# EAGLE design new main (EAGLE 6.5.0)
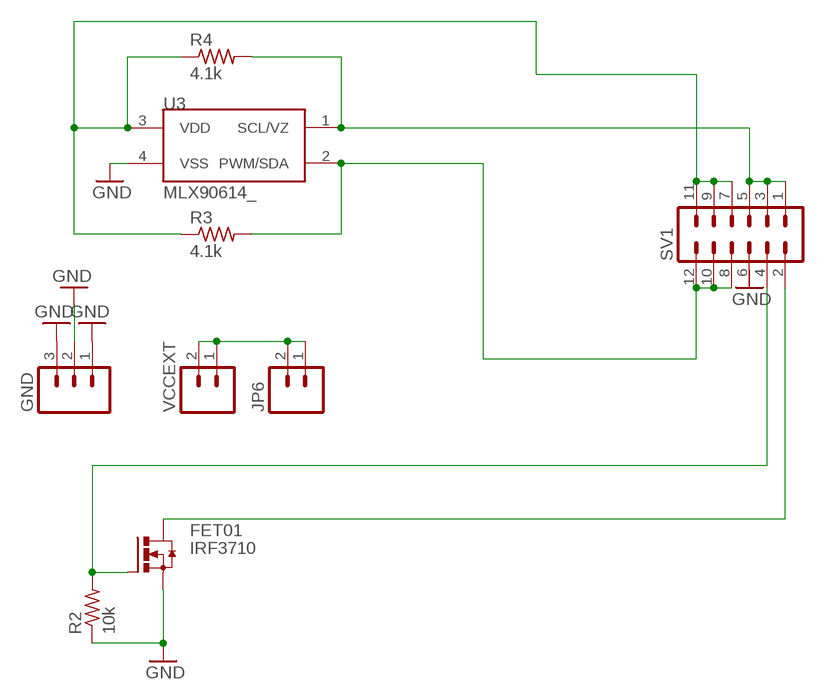
[diagram p0: schematic, sheet 1]

## Parts
FET01  IRF3710  IRF3704  [TO220AH]
GND  M03LONGPADS  [1X03_LONGPADS]
JP6  M02LOCK_LONGPADS  [1X02_LOCK_LONGPADS]
R2  10k  R-US_0207/7  [0207/7]
R3  4.1k  R-US_0204/5  [0204/5]
R4  4.1k  R-US_0204/5  [0204/5]
SV1  MA06-2  [MA06-2]
U3  MLX90614_  [TO-39]
VCCEXT  M02LOCK_LONGPADS  [1X02_LOCK_LONGPADS]

## Nets
GND: FET01.E(S) GND.1 GND.2 GND.3 R2.1 U3.4(VSS)
N$1: JP6.1 JP6.2 VCCEXT.1 VCCEXT.2
N$2: FET01.C(D) SV1.2
N$15: R4.2 SV1.1 SV1.3 SV1.5 U3.1(SCL/VZ)
N$16: R3.2 SV1.8 SV1.10 SV1.12 U3.2(PWM/SDA)
N$18: FET01.B(G) R2.2 SV1.4
VCC3: R3.1 R4.1 SV1.7 SV1.9 SV1.11 U3.3(VDD)
Unconnected: SV1.6

## Library data of the parts
FET01 = transistor-power:IRF3704: SMPS MOSFET HEXFET® Power MOSFET Source: http://www.irf.com/product-info/datasheets/data/irf3704.pdf
GND = SparkFun-Connectors:M03: Header 3 Standard 3-pin 0.1" header. Use with straight break away headers (SKU : PRT-00116), right angle break away headers (PRT-00553), swiss pins (PRT-00743), machine pins (PRT-00117), and female headers (PRT-00115). Molex polarized connector foot print use with SKU : PRT-08232 with associated crimp pins and housings.
JP6 VCCEXT = SparkFun-Connectors:M02: Header 2 Standard 2-pin 0.1" header. Use with straight break away headers (SKU : PRT-00116), right angle break away headers (PRT-00553), swiss pins (PRT-00743), machine pins (PRT-00117), and female headers (PRT-00115). Molex polarized connector foot print use with SKU : PRT-08233 with associated crimp pins and housings.
R2-R4 = rcl:R-US_: RESISTOR, American symbol
SV1 = con-lstb:MA06-2: PIN HEADER; OC_FARNELL: unknown; OC_NEWARK: unknown
U3 = SparkFun-Sensors:MLX90614: Non-contact PIR I2C interface temperature sensor

## Board
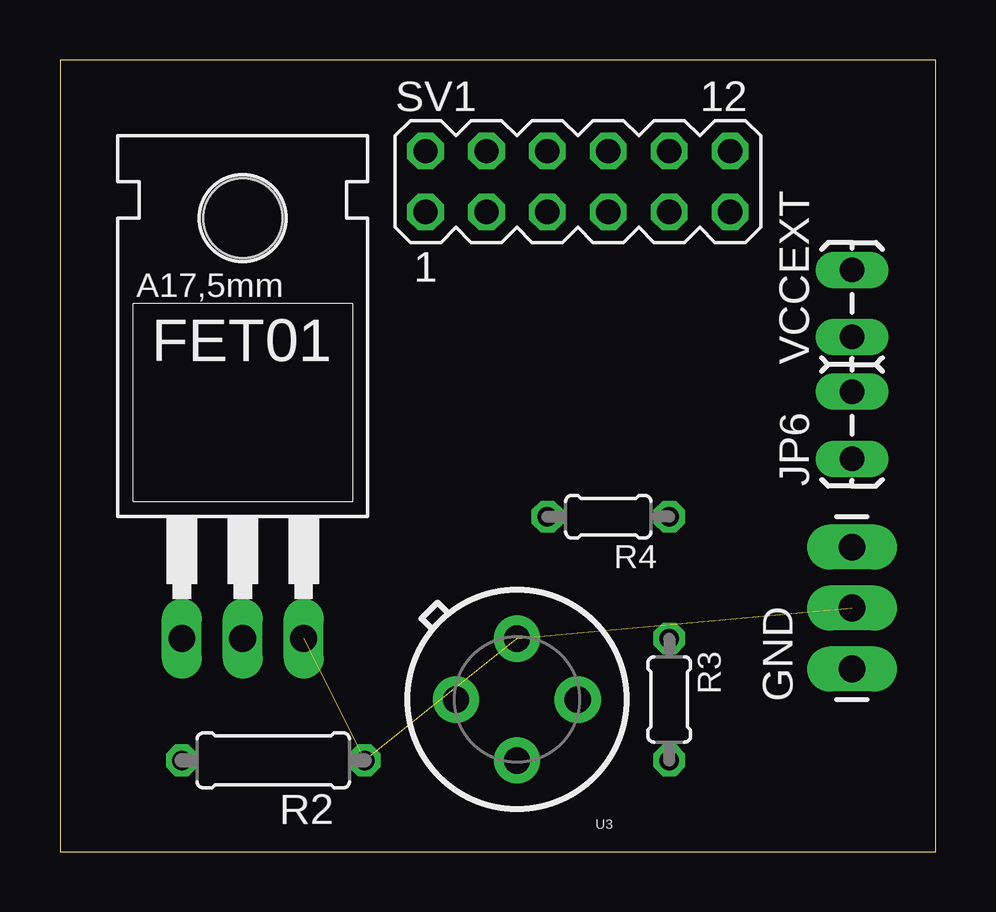
[diagram p1: board, top side]
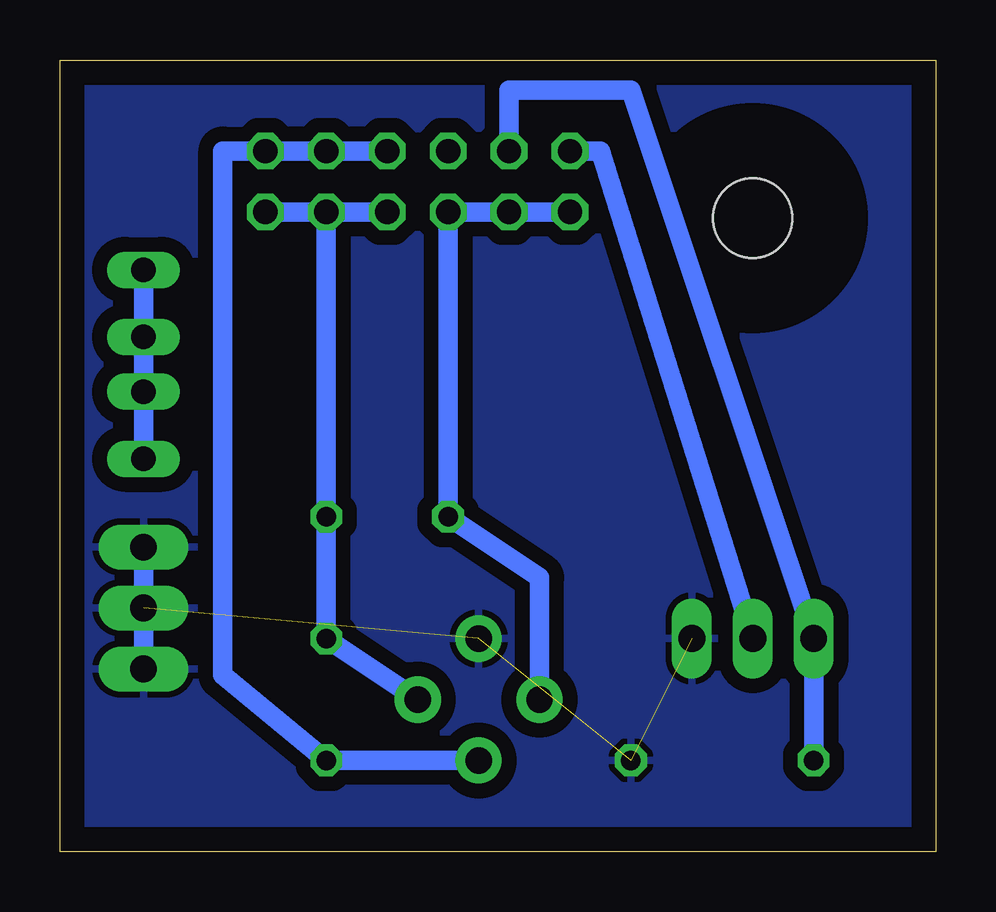
[diagram p2: board, bottom side, seen from below]

Size 36.5 x 33.01 mm. Coordinates in mm from the lower left corner, seen from the top.
Outline: 0,0 36.5,0 36.5,33.01 0,33.01 0,0
Copper layers (1*16): Top 0.035mm / dielectric 1.5mm / Bottom 0.035mm
Design rules "default": minimum track width 10mil, minimum drill 24mil, track to track 8mil, track to pad 8mil, pad to pad 8mil, via to via 8mil, smd to smd 8mil, copper to edge 40mil, drill to drill 8mil, minimum pad ring 10mil, minimum via ring 8mil, stop-mask expansion 4mil, vias tented up to drill 0mil, thermal gap 10mil

### Footprints (pad centres in the part's own frame; a part is rotated, then mirrored left to right if it is on the bottom)
TO220AH = drill 1.118 long: B -2.54,-6.35; C 0,-6.35; E 2.54,-6.35 | hole 3.302: 0,11.176
1X03_LONGPADS = drill 1.118 pad 1.88 long: 1 0,0; 2 2.54,0; 3 5.08,0
1X02_LOCK_LONGPADS = drill 1.016 long: 1 -0.127,0; 2 2.667,0
0207/7 = drill 0.813 octagon: 1 -3.81,0; 2 3.81,0
0204/5 = drill 0.813 octagon: 1 -2.54,0; 2 2.54,0
MA06-2 = drill 1.016 octagon: 1 -6.35,-1.27; 2 -6.35,1.27; 3 -3.81,-1.27; 4 -3.81,1.27; 5 -1.27,-1.27; 6 -1.27,1.27; 7 1.27,-1.27; 8 1.27,1.27; 9 3.81,-1.27; 10 3.81,1.27; 11 6.35,-1.27; 12 6.35,1.27
TO-39 = drill 1.1 pad 1.93: 1 2.54,0; 2 0,2.54; 3 -2.54,0; 4 0,-2.54

### Placement (x,y rotation side)
FET01  7.62,15.24 0 top
GND  33.02,7.62 90 top
JP6  33.02,16.51 90 top
R2  8.89,3.81 180 top
R3  25.4,6.35 270 top
R4  22.86,13.97 180 top
SV1  21.59,27.94 0 top
U3  19.05,6.35 180 top
VCCEXT  33.02,21.59 90 top

### Tracks (layer width: path | path; a pad name or v marks a point on that pad's centre or on a via)
GND  (3 unrouted)
  Bottom 0.813: GND.3 GND.2 GND.1
  pour Bottom (isolate 0.61): 0.51,32.51 36.07,32.51 36.07,0.51 0.51,0.51
N$1
  Bottom 0.813: JP6.1 JP6.2 VCCEXT.1 VCCEXT.2
N$2
  Bottom 0.813: SV1.2 13.97,29.21 FET01.C
N$15
  Bottom 0.813: U3.1 16.51,11.43 R4.2 SV1.5 SV1.3 SV1.1
N$16
  Bottom 0.813: U3.2 R3.2 29.72,7.37 29.72,29.21 SV1.12 SV1.10 SV1.8
N$18
  Bottom 0.813: R2.2 FET01.B 12.7,31.75 17.78,31.75 SV1.4
VCC3
  Bottom 0.813: U3.3 R3.1 R4.1 SV1.9 | SV1.7 SV1.9 | SV1.9 SV1.11